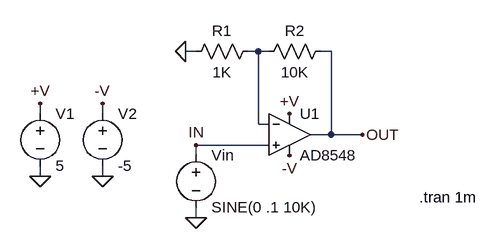
[diagram p0: schematic AD8548.asc]
AD8548.asc, the LTspice schematic file:
Version 4
SHEET 1 1432 700
WIRE 368 -1184 352 -1184
WIRE 464 -1184 448 -1184
WIRE 480 -1184 464 -1184
WIRE 576 -1184 560 -1184
WIRE 128 -1088 128 -1104
WIRE 224 -1088 224 -1104
WIRE 464 -1072 464 -1184
WIRE 480 -1072 464 -1072
WIRE 576 -1056 576 -1184
WIRE 576 -1056 544 -1056
WIRE 624 -1056 576 -1056
WIRE 480 -1040 368 -1040
WIRE 368 -1024 368 -1040
WIRE 128 -992 128 -1008
WIRE 224 -992 224 -1008
WIRE 368 -928 368 -944
FLAG 368 -928 0
FLAG 624 -1056 OUT
FLAG 368 -1040 IN
FLAG 512 -1088 +V
FLAG 512 -1024 -V
FLAG 352 -1184 0
FLAG 128 -1104 +V
FLAG 128 -992 0
FLAG 224 -1104 -V
FLAG 224 -992 0
SYMBOL voltage 368 -1040 R0
WINDOW 123 24 146 Left 2
WINDOW 39 24 125 Left 2
SYMATTR InstName Vin
SYMATTR Value SINE(0 .1 10K)
SYMBOL res 576 -1200 R90
WINDOW 0 0 56 VBottom 2
WINDOW 3 32 56 VTop 2
SYMATTR InstName R2
SYMATTR Value 10K
SYMBOL Opamps\\AD8548 512 -1120 R0
SYMATTR InstName U1
SYMBOL res 464 -1200 R90
WINDOW 0 0 56 VBottom 2
WINDOW 3 32 56 VTop 2
SYMATTR InstName R1
SYMATTR Value 1K
SYMBOL voltage 128 -1104 R0
WINDOW 123 0 0 Left 2
WINDOW 39 0 0 Left 2
SYMATTR InstName V1
SYMATTR Value 5
SYMBOL voltage 224 -1104 R0
WINDOW 123 24 146 Left 2
WINDOW 39 24 125 Left 2
SYMATTR InstName V2
SYMATTR Value -5
TEXT 712 -960 Left 2 !.tran 1m

The netlist it stands for:
* AD8548.asc
Vin IN 0 SINE(0 .1 10K)
R2 OUT N001 10K
XU1 IN N001 +V -V OUT AD8548  ; pins In+ In- V+ V- OUT
R1 N001 0 1K
V1 +V 0 5
V2 -V 0 -5
.tran 1m
.backanno
.end